# EAGLE design quadrotor (EAGLE 6.5.0)
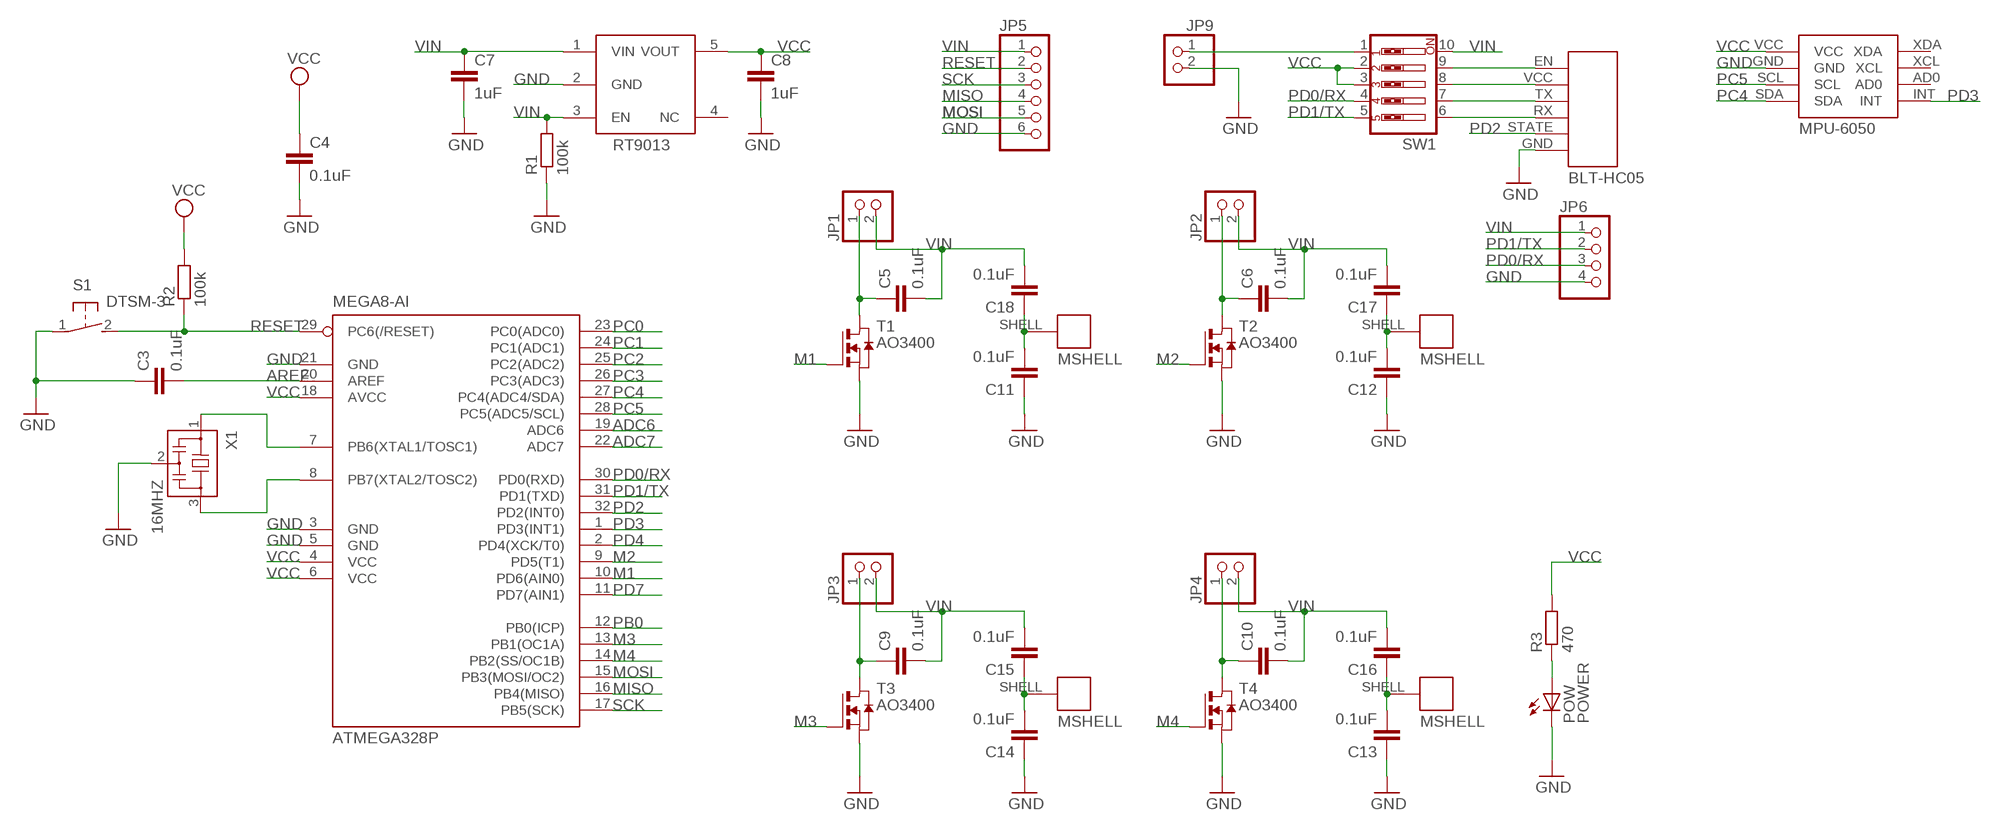
[diagram p0: schematic, sheet 1]

## Parts
ATMEGA328P  MEGA8-AI  [TQFP32-08]
C3  0.1uF  CC0603  [C0603]
C4  0.1uF  CC0603  [C0603]
C5  0.1uF  CC0603  [C0603]
C6  0.1uF  CC0603  [C0603]
C7  1uF  CC0603  [C0603]
C8  1uF  CC0603  [C0603]
C9  0.1uF  CC0603  [C0603]
C10  0.1uF  CC0603  [C0603]
C11  0.1uF  CC0603  [C0603]
C12  0.1uF  CC0603  [C0603]
C13  0.1uF  CC0603  [C0603]
C14  0.1uF  CC0603  [C0603]
C15  0.1uF  CC0603  [C0603]
C16  0.1uF  CC0603  [C0603]
C17  0.1uF  CC0603  [C0603]
C18  0.1uF  CC0603  [C0603]
JP1  PINHD-1X2  [1X02]
JP2  PINHD-1X2  [1X02]
JP3  PINHD-1X2  [1X02]
JP4  PINHD-1X2  [1X02]
JP5  PINHD-1X6  [1X06]
JP6  PINHD-1X4  [1X04]
JP9  PINHD-1X2  [1X02]
POW  POWER  LED_ESML0603  [LED_SML0603]
R1  100k  RR0603  [R0603]
R2  100k  RR0603  [R0603]
R3  470  RR0603  [R0603]
S1  DTSM-3  [DTSM-3]
SW1  SW_DIP-5  [EDG-05]
T1  AO3400  NMOSSOT23  [SOT-23]
T2  AO3400  NMOSSOT23  [SOT-23]
T3  AO3400  NMOSSOT23  [SOT-23]
T4  AO3400  NMOSSOT23  [SOT-23]
U$1  RT9013  [SOT-23-5]
U$2  BLT-HC05  [BLT-HC05]
U$3  720-MSHELL  [720MOTOR]
U$4  720-MSHELL  [720MOTOR]
U$5  720-MSHELL  [720MOTOR]
U$6  720-MSHELL  [720MOTOR]
U$7  MPU-6050  [MPU-6050]
X1  16MHZ  CSTCR6M00G53Z  [CSTCR6M]

## Nets
ADC6: ATMEGA328P.19(ADC6)
ADC7: ATMEGA328P.22(ADC7)
AREF: ATMEGA328P.20(AREF) C3.2
GND: ATMEGA328P.3(GND) ATMEGA328P.5(GND) ATMEGA328P.21(GND) C3.1 C4.2 C7.2 C8.2 C11.1 C12.1 C13.1 C14.1 JP5.6 JP6.4 JP9.2 POW.C R1.1 S1.1 T1.2(S) T2.2(S) T3.2(S) T4.2(S) U$1.2(GND) U$2.GND U$7.GND X1.2
M1: ATMEGA328P.10(PD6(AIN0)) T1.3(G)
M2: ATMEGA328P.9(PD5(T1)) T2.3(G)
M3: ATMEGA328P.13(PB1(OC1A)) T3.3(G)
M4: ATMEGA328P.14(PB2(SS/OC1B)) T4.3(G)
MISO: ATMEGA328P.16(PB4(MISO)) JP5.4
MOSI: ATMEGA328P.15(PB3(MOSI/OC2)) JP5.5
N$1: ATMEGA328P.7(PB6(XTAL1/TOSC1)) X1.1
N$2: ATMEGA328P.8(PB7(XTAL2/TOSC2)) X1.3
N$3: C14.2 C15.1 U$5.SHELL
N$4: C5.1 JP1.1 T1.1(D)
N$5: C11.2 C18.1 U$3.SHELL
N$6: C6.1 JP2.1 T2.1(D)
N$7: SW1.9 U$2.EN
N$8: POW.A R3.1
N$9: C10.1 JP4.1 T4.1(D)
N$10: C9.1 JP3.1 T3.1(D)
N$11: SW1.8 U$2.VCC
N$12: SW1.7 U$2.TX
N$13: SW1.6 U$2.RX
N$14: JP9.1 SW1.1
N$15: C12.2 C17.1 U$4.SHELL
N$16: C13.2 C16.1 U$6.SHELL
PB0: ATMEGA328P.12(PB0(ICP))
PC0: ATMEGA328P.23(PC0(ADC0))
PC1: ATMEGA328P.24(PC1(ADC1))
PC2: ATMEGA328P.25(PC2(ADC2))
PC3: ATMEGA328P.26(PC3(ADC3))
PC4: ATMEGA328P.27(PC4(ADC4/SDA)) U$7.SDA
PC5: ATMEGA328P.28(PC5(ADC5/SCL)) U$7.SCL
PD0/RX: ATMEGA328P.30(PD0(RXD)) JP6.3 SW1.4
PD1/TX: ATMEGA328P.31(PD1(TXD)) JP6.2 SW1.5
PD2: ATMEGA328P.32(PD2(INT0)) U$2.STATE
PD3: ATMEGA328P.1(PD3(INT1)) U$7.INT
PD4: ATMEGA328P.2(PD4(XCK/T0))
PD7: ATMEGA328P.11(PD7(AIN1))
RESET: ATMEGA328P.29(PC6(/RESET)) JP5.2 R2.1 S1.2
SCK: ATMEGA328P.17(PB5(SCK)) JP5.3
VCC: ATMEGA328P.4(VCC) ATMEGA328P.6(VCC) ATMEGA328P.18(AVCC) C4.1 C8.1 R2.2 R3.2 SW1.2 SW1.3 U$1.5(VOUT) U$7.VCC
VIN: C5.2 C6.2 C7.1 C9.2 C10.2 C15.2 C16.2 C17.2 C18.2 JP1.2 JP2.2 JP3.2 JP4.2 JP5.1 JP6.1 R1.2 SW1.10 U$1.1(VIN) U$1.3(EN)
Unconnected: U$1.4(NC) U$7.AD0 U$7.XCL U$7.XDA

## Library data of the parts
ATMEGA328P = atmel:MEGA8: MICROCONTROLLER 8 Kbytes FLASH, 1 kbytes SRAM, 512 bytes EEPROM, USART, 6-channel 10 bit ADC, 2-channel 8 bit ADC Pin compatible with Atmega48, ATMega88, ATMega168 Source: avr.lbr; MPN: ATMEGA8-16AU; OC_FARNELL: 9171371; OC_NEWARK: 73M8863
C3-C18 = eagle-ltspice:C: CAPACITOR, European symbol; SPICEMODEL: NONE; SPICEPREFIX: C
JP1-JP4 JP9 = pinhead:PINHD-1X2: PIN HEADER
JP5 = pinhead:PINHD-1X6: PIN HEADER
JP6 = pinhead:PINHD-1X4: PIN HEADER
POW = eagle-ltspice:LED_E: LED Source: http://www.osram.convergy.de Source: www.luxeon.com Source: www.kingbright.com; SPICEMODEL: NONE; SPICEPREFIX: D; SPICETYPE: diode
R1-R3 = eagle-ltspice:R: RESISTOR, European symbol; SPICEMODEL: NONE; SPICEPREFIX: R
S1 = switch-tact:DTSM-3
SW1 = special:SW_DIP-5: DIP SWITCH
T1-T4 = zetex:NMOSSOT23: MOS FET; OC_FARNELL: unknown; OC_NEWARK: unknown
U$1 = quadrotor:RT9013
U$2 = quadrotor:BLT-HC05
U$3-U$6 = quadrotor:720-MSHELL
U$7 = quadrotor:MPU-6050
X1 = murata-filter:CSTCR: Resonator Source: murata.co.jp; MPN: CSTCR6M00G53-R0; OC_FARNELL: 1170434; OC_NEWARK: 25M8759

## Net classes
0 default: clearance 0.205 mm

## Board
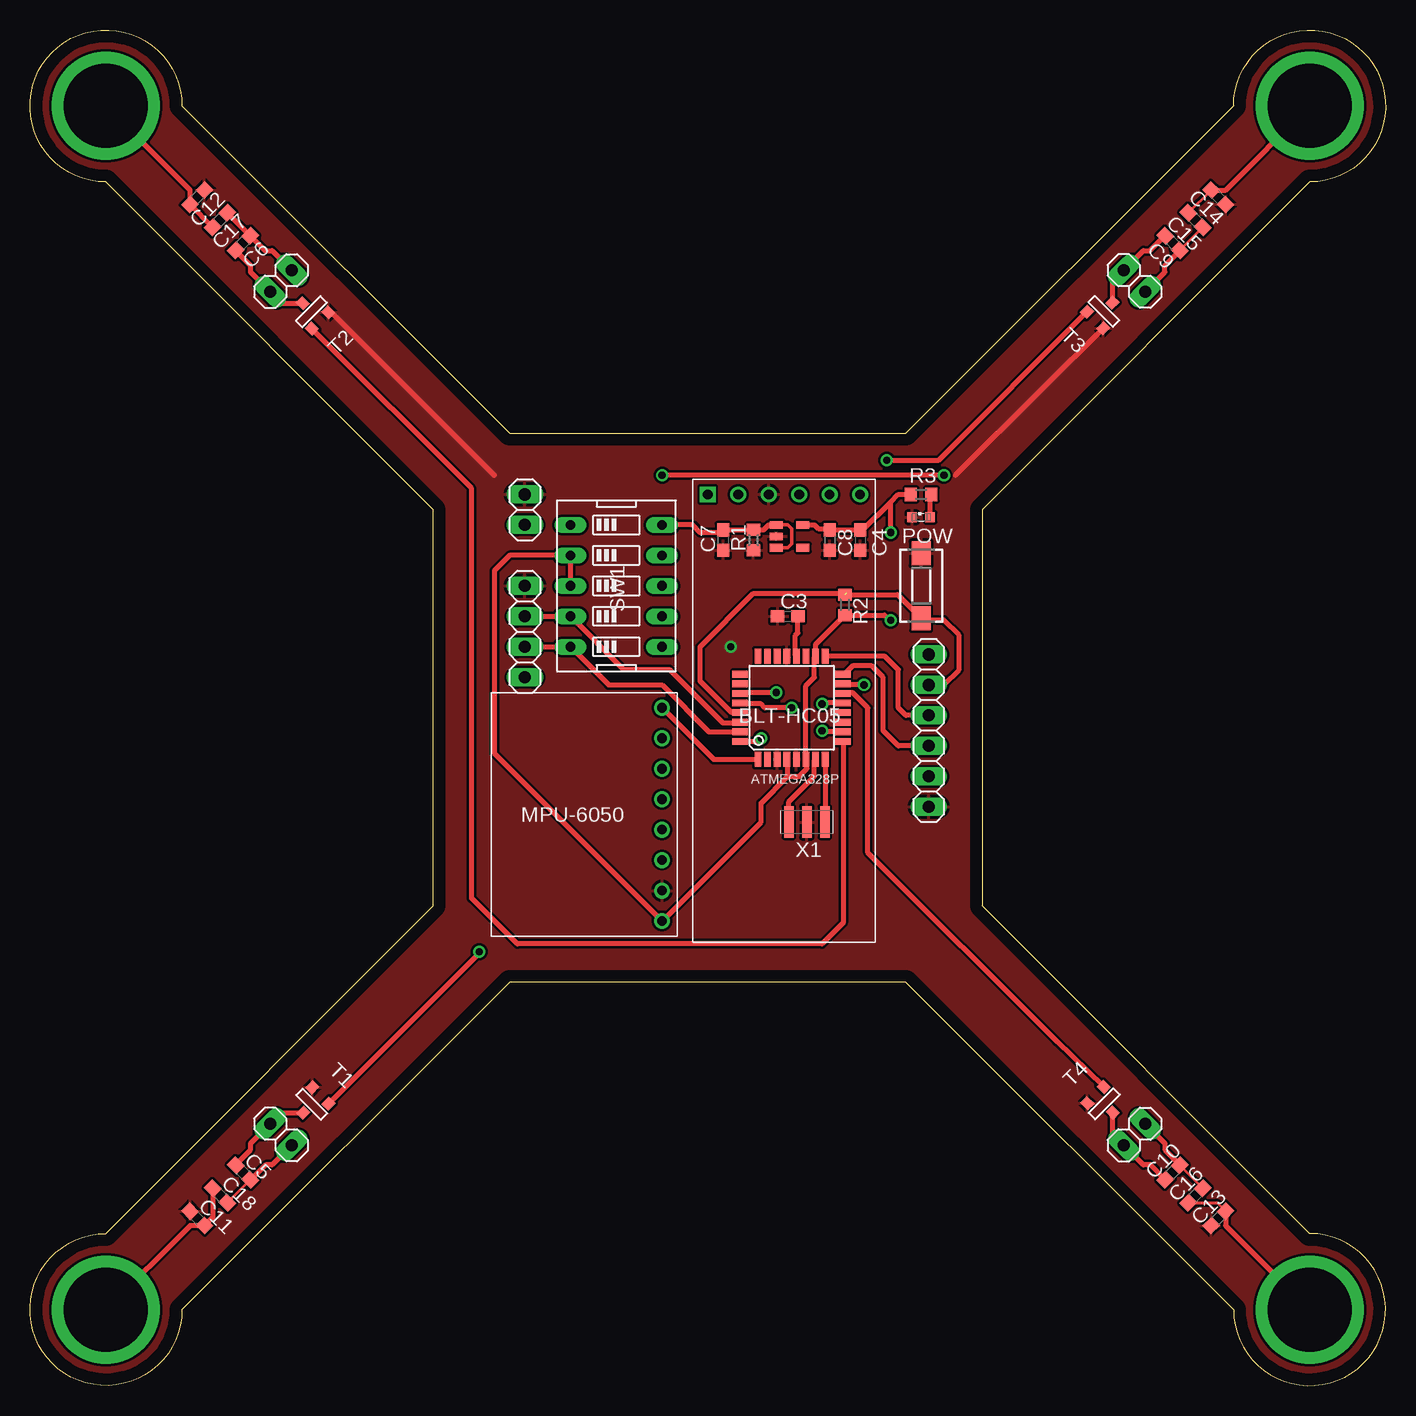
[diagram p1: board, top side]
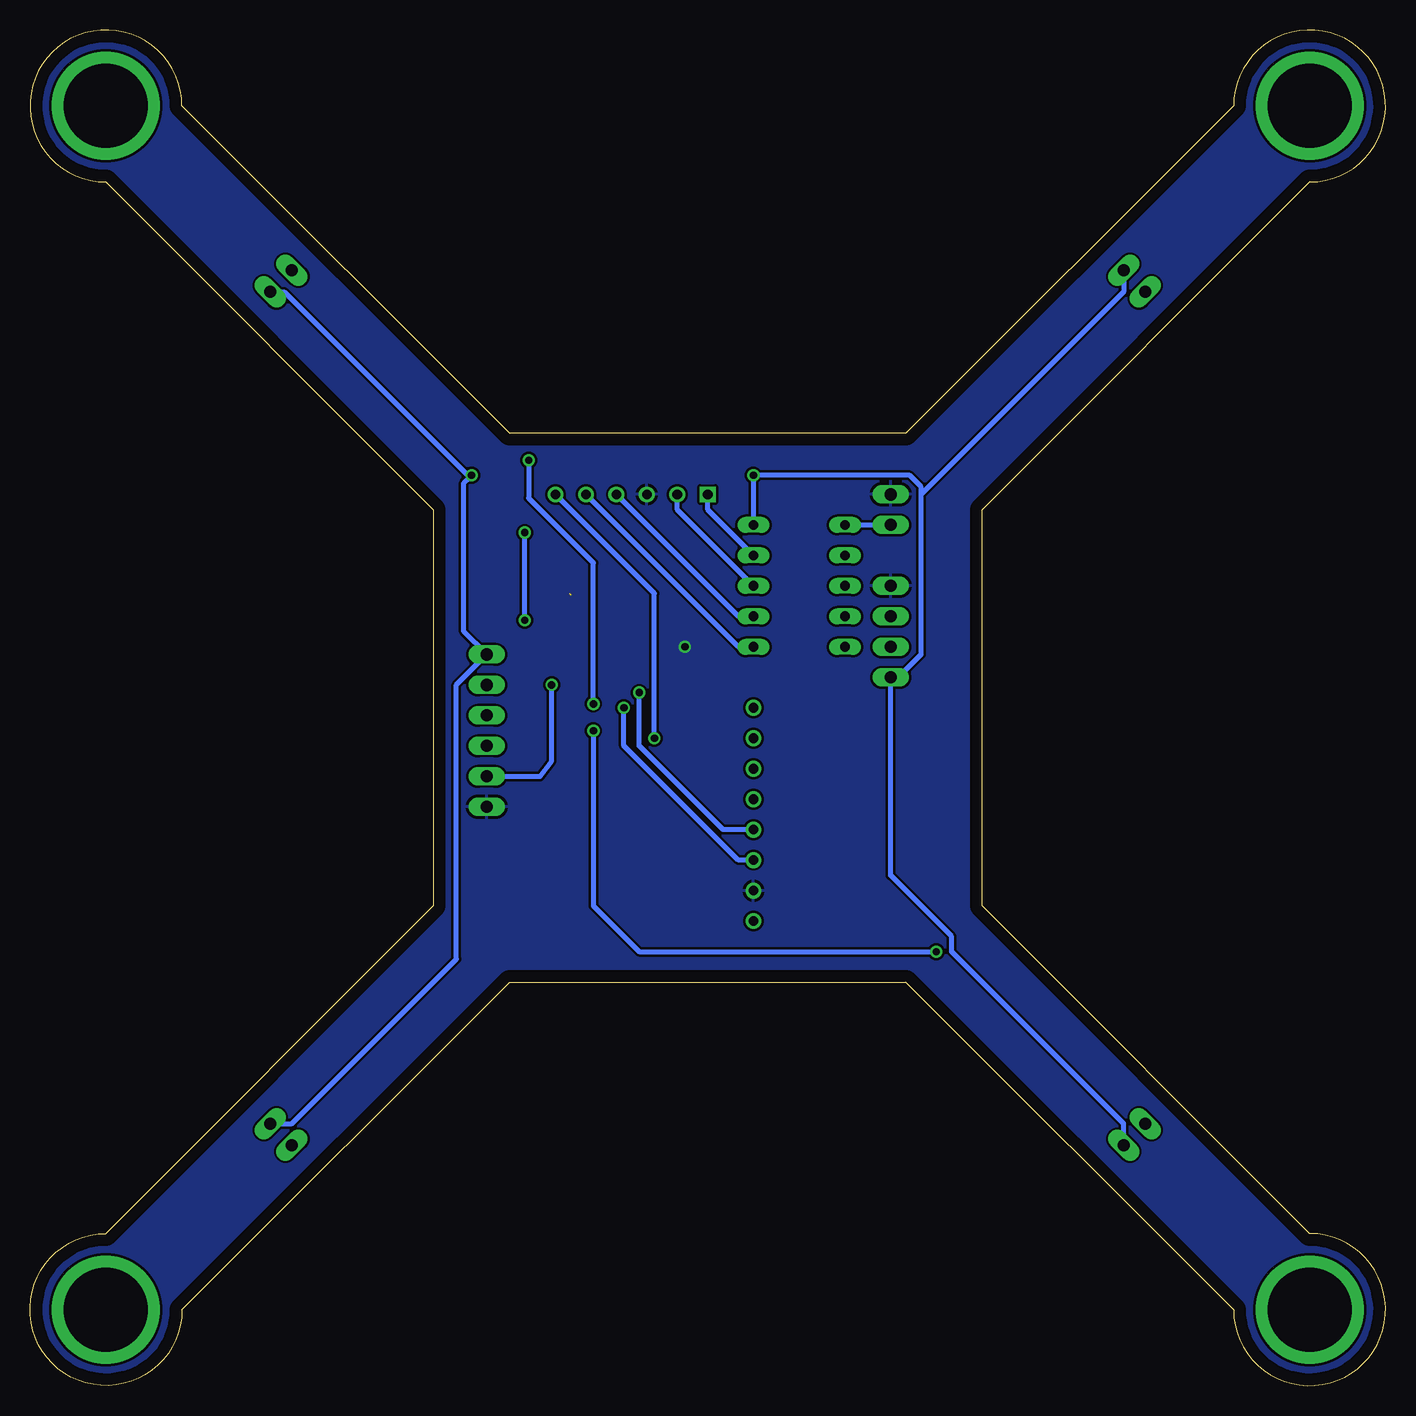
[diagram p2: board, bottom side, seen from below]

Size 112.96 x 112.96 mm. Coordinates in mm from the lower left corner, seen from the top.
Outline: 39.97,79.34 72.99,79.34 100.3,106.65 arc-270 106.65,100.3 79.34,72.99 79.34,39.97 106.65,12.67 arc-270 100.3,6.32 72.99,33.62 39.97,33.62 12.67,6.32 arc-270 6.32,12.67 33.62,39.97 33.62,72.99 6.32,100.3 arc-270 12.67,106.65 39.97,79.34
Copper layers (1*16): Top 0.035mm / dielectric 1.5mm / Bottom 0.035mm
Design rules "default": minimum track width 10mil, minimum drill 24mil, track to track 8mil, track to pad 8mil, pad to pad 8mil, via to via 8mil, smd to smd 8mil, copper to edge 40mil, drill to drill 8mil, minimum pad ring 10mil, minimum via ring 8mil, stop-mask expansion 4mil, vias tented up to drill 0mil, thermal gap 10mil

### Footprints (pad centres in the part's own frame; a part is rotated, then mirrored left to right if it is on the bottom)
TQFP32-08 = smd 1.27 x 0.559: 1 -4.293,2.8; 2 -4.293,2; 3 -4.293,1.2; 4 -4.293,0.4; 5 -4.293,-0.4; 6 -4.293,-1.2; 7 -4.293,-2; 8 -4.293,-2.8; 17 4.293,-2.8; 18 4.293,-2; 19 4.293,-1.2; 20 4.293,-0.4; 21 4.293,0.4; 22 4.293,1.2; 23 4.293,2; 24 4.293,2.8 | smd 0.559 x 1.27: 9 -2.8,-4.293; 10 -2,-4.293; 11 -1.2,-4.293; 12 -0.4,-4.293; 13 0.4,-4.293; 14 1.2,-4.293; 15 2,-4.293; 16 2.8,-4.293; 25 2.8,4.293; 26 2,4.293; 27 1.2,4.293; 28 0.4,4.293; 29 -0.4,4.293; 30 -1.2,4.293; 31 -2,4.293; 32 -2.8,4.293
C0603 = smd 1.1 x 1: 1 -0.85,0; 2 0.85,0
1X02 = drill 1.016 long: 1 -1.27,0; 2 1.27,0
1X06 = drill 1.016 long: 1 -6.35,0; 2 -3.81,0; 3 -1.27,0; 4 1.27,0; 5 3.81,0; 6 6.35,0
1X04 = drill 1.016 long: 1 -3.81,0; 2 -1.27,0; 3 1.27,0; 4 3.81,0
LED_SML0603 = smd 0.8 x 0.8: A 0.75,0; C -0.75,0
R0603 = smd 1 x 1.1: 1 -0.85,0; 2 0.85,0
DTSM-3 = smd 2 x 1.6: 1 -2.7,0; 2 2.7,0
EDG-05 = drill 0.813 long: 1 -5.08,-3.81; 2 -2.54,-3.81; 3 0,-3.81; 4 2.54,-3.81; 5 5.08,-3.81; 6 5.08,3.81; 7 2.54,3.81; 8 0,3.81; 9 -2.54,3.81; 10 -5.08,3.81
SOT-23 = smd 0.787 x 0.889: 1 0.025,-1.016; 2 -0.94,1.016; 3 0.991,1.016
SOT-23-5 = smd 1.067 x 0.635: 1 0,0; 2 0,-0.953; 3 0,-1.905; 4 2.21,-1.905; 5 2.21,0
BLT-HC05 = drill 0.8 square: EN 0,0 | drill 0.8: GND 5.08,0; RX 10.16,0; STATE 12.7,0; TX 7.62,0; VCC 2.54,0
720MOTOR = drill 7 pad 9: SHELL 0,0
MPU-6050 = drill 0.8: AD0 0,-15.24; GND 0,-2.54; INT 0,-17.78; SCL 0,-5.08; SDA 0,-7.62; VCC 0,0; XCL 0,-12.7; XDA 0,-10.16
CSTCR6M = smd 0.8 x 2.6: 1 -1.5,0; 2 0,0; 3 1.5,0

### Placement (x,y rotation side)
ATMEGA328P  63.47,56.48 90 top
C3  63.15,64.1 0 top
C4  69.18,70.45 270 top
C5  17.75,17.75 315 top
C6  17.75,95.22 45 top
C7  57.75,70.45 270 top
C8  66.64,70.45 270 top
C9  95.22,95.22 315 top
C10  95.22,17.75 45 top
C11  13.94,13.94 315 top
C12  13.94,99.03 225 top
C13  99.03,13.94 45 top
C14  99.03,99.03 135 top
C15  97.12,97.12 315 top
C16  97.12,15.84 45 top
C17  15.84,97.12 45 top
C18  15.84,15.84 315 top
JP1  20.92,20.92 315 top
JP2  20.92,92.04 45 top
JP3  92.04,92.04 315 top
JP4  92.04,20.92 45 top
JP5  74.9,54.58 270 top
JP6  41.24,62.83 90 top
JP9  41.24,72.99 90 top
POW  74.26,72.36 0 top
R1  60.29,70.45 90 top
R2  67.91,65.05 270 top
R3  74.26,74.26 180 top
S1  74.26,66.64 270 top
SW1  48.86,66.64 270 top
T1  23.46,23.46 315 top
T2  23.46,89.5 225 top
T3  89.5,89.5 135 top
T4  89.5,23.46 45 top
U$1  62.2,71.72 0 top
U$2  56.48,74.26 0 top
U$3  6.32,6.32 0 top
U$4  6.32,106.65 0 top
U$5  106.65,106.65 0 top
U$6  106.65,6.32 0 top
U$7  52.67,38.7 180 top
X1  64.74,46.96 0 top

### Tracks (layer width: path | path; a pad name or v marks a point on that pad's centre or on a via)
AREF
  Top 0.406: ATMEGA328P.20 63.78,60.86 63.78,62.51 64,62.73 C3.2
GND  (via drill 0.6)
  Top 0.406: T2.2 25.1,89.45 38.7,75.85 | T3.2 84.31,83.04 77.12,75.85
  other vias: 58.39,61.56
  pour Top: -0.67,113.63 113.63,113.63 113.63,-0.67 -0.67,-0.67
  pour Bottom: 0.6,113 113,113 113,-0.03 -0.03,-0.03 -0.03,113
M1  (via drill 0.6)
  Top 0.406: ATMEGA328P.10 66.1,54.48 v66.01,54.58 | v37.43,36.16 37.43,36.03 T1.3
  Bottom 0.406: v66.01,54.58 66.01,39.97 62.2,36.16 v37.43,36.16
M2
  Top 0.406: ATMEGA328P.9 67.76,38.55 66.01,36.8 40.61,36.8 36.8,40.61 36.8,74.77 T2.3
M3  (via drill 0.6)
  Top 0.406: ATMEGA328P.13 66.09,56.88 v66.01,56.8 | v71.4,77.12 75.72,77.12 T3.3
  Bottom 0.406: v66.01,56.8 66.01,68.55 71.4,73.94 v71.4,77.12
M4
  Top 0.406: T4.3 85.54,28.69 69.82,44.42 69.82,56.48 68.55,57.75 67.83,57.75 ATMEGA328P.14
MISO
  Top 0.406: 67.82,59.34 ATMEGA328P.16 67.85,59.28 68.55,59.97 70.13,59.97 71.09,59.02 71.09,54.58 72.36,53.31 JP5.4
MOSI  (via drill 0.6)
  Top 0.406: v69.5,58.39 67.85,58.39 ATMEGA328P.15
  Bottom 0.406: JP5.5 70.45,50.77 69.5,52.04 v69.5,58.39
N$1
  Top 0.406: X1.1 63.24,48.63 65.37,50.77 65.37,52.09 ATMEGA328P.7
N$2
  Top 0.406: ATMEGA328P.8 66.27,46.99 X1.3
N$3
  Top 0.254: C15.1 C14.2
  Top 0.406: C14.2 99.63,99.63 U$5.SHELL
N$4
  Top 0.406: C5.1 17.15,18.42 18.38,19.65 18.38,20.18 JP1.1 20.93,22.73 T1.1
N$5
  Top 0.406: C18.1 15.24,14.04 C11.2 13.34,13.34 U$3.SHELL
N$6
  Top 0.406: T2.1 20.96,90.2 JP2.1 18.38,92.79 18.38,93.31 17.15,94.55 C6.1
N$7
  Bottom 0.406: SW1.9 56.48,72.99 U$2.EN
N$8
  Top 0.406: POW.A 75.01,74.16 R3.1
N$9
  Top 0.406: C10.1 93.38,18.38 92.79,18.38 JP4.1 90.24,20.93 T4.1
N$10
  Top 0.406: C9.1 94.55,95.82 93.31,94.58 92.79,94.58 JP3.1 90.2,92 T3.1
N$11
  Bottom 0.406: SW1.8 59.02,72.99 U$2.VCC
N$12
  Bottom 0.406: SW1.7 53.94,64.1 U$2.TX
N$13
  Bottom 0.406: SW1.6 53.94,61.56 U$2.RX
N$14
  Bottom 0.406: SW1.1 JP9.1
N$15
  Top 0.406: C17.1 C12.2 13.34,99.63 U$4.SHELL
N$16
  Top 0.254: C16.1 98.92,15.24 C13.2
  Top 0.406: C13.2 99.63,13.34 U$6.SHELL
PC4  (via drill 0.6)
  Top 0.406: v62.2,57.75 59.24,57.75 ATMEGA328P.27
  Bottom 0.406: U$7.SDA 55.21,46.32 62.2,53.31 v62.2,57.75
PC5  (via drill 0.6)
  Top 0.406: v63.47,56.48 61.24,56.48 60.93,56.8 59.26,56.8 ATMEGA328P.28
  Bottom 0.406: U$7.SCL 53.94,43.78 63.47,53.31 v63.47,56.48
PD0/RX
  Top 0.406: ATMEGA328P.30 59.1,55.21 57.75,55.21 53.31,59.66 49.5,59.66 SW1.4 JP6.3
PD1/TX
  Top 0.406: ATMEGA328P.31 56.58,54.48 52.67,58.39 48.23,58.39 SW1.5 JP6.2
PD2  (via drill 0.6)
  Top 0.406: ATMEGA328P.32 60.67,53.68 v60.93,53.94
  Bottom 0.406: v60.93,53.94 60.93,66.01 U$2.STATE
PD3
  Top 0.406: U$7.INT 56.96,52.19 ATMEGA328P.1
RESET  (1 unrouted)
  Top 0.406: ATMEGA328P.29 58.47,56.08 55.85,58.7 55.85,61.56 60.29,66.01 68.01,66.01 | R2.1 72.3,65.9 S1.2 74.42,63.78 76.17,63.78 77.44,62.51 77.44,59.66 76.17,58.39 JP5.2
SCK
  Top 0.406: JP5.3 72.99,55.85 72.36,56.48 72.36,59.66 71.24,60.77 ATMEGA328P.17
VCC  (via drill 0.6)
  Top 0.406: U$1.5 65.37,71.72 65.69,71.4 66.54,71.4 C8.1 C4.1 69.4,71.3 71.72,73.63 | 71.72,73.63 72.36,74.26 R3.2 | 63.15,50.77 60.93,48.54 60.93,46.96 U$7.VCC 38.7,52.67 38.7,67.91 39.97,69.18 SW1.2 SW1.3 | 63.15,50.77 64.1,50.77 64.74,51.4 64.74,52.12 ATMEGA328P.6 64.67,58.32 65.37,59.02 65.37,60.68 ATMEGA328P.18 65.47,61.76 R2.2 71.19,64.2 v71.72,63.78 | 63.15,50.77 63.15,52.11 ATMEGA328P.4 | v71.72,71.09 71.72,73.63
  Bottom 0.406: v71.72,63.78 v71.72,71.09
VIN  (via drill 0.6)
  Top 0.254: C5.2 C18.2 | C10.2 C16.2 | C9.2 C15.2
  Top 0.305: U$1.3 63.15,69.82 63.47,70.13 63.47,71.4 63.15,71.72 U$1.1
  Top 0.406: U$1.1 61.56,71.72 61.14,71.3 R1.2 C7.1 57.65,71.4 57.33,71.09 55.85,71.09 55.21,71.72 SW1.10 | C17.2 C6.2 19.58,94.58 20.18,94.58 JP2.2 | JP1.2 20.18,18.38 19.65,18.38 18.42,17.15 C5.2 | JP4.2 94.58,20.18 94.58,19.65 95.82,18.42 C10.2 | JP3.2 94.58,92.79 94.58,93.31 95.82,94.55 C9.2 | v76.17,75.85 v52.67,75.85
  Bottom 0.406: 76.33,75.69 76.8,75.21 76.8,62.83 JP5.1 77.44,58.39 77.44,35.53 91.14,21.82 JP4.2 | 76.33,75.69 v76.17,75.85 | 38.7,74.26 38.7,60.93 40.61,59.02 JP6.1 41.24,42.51 36.16,37.43 36.16,36.16 21.82,21.82 JP1.2 | 38.7,74.26 38.7,74.9 39.65,75.85 v52.67,75.85 SW1.10 | JP2.2 21.82,91.14 38.7,74.26 | JP3.2 91.78,91.14 76.33,75.69